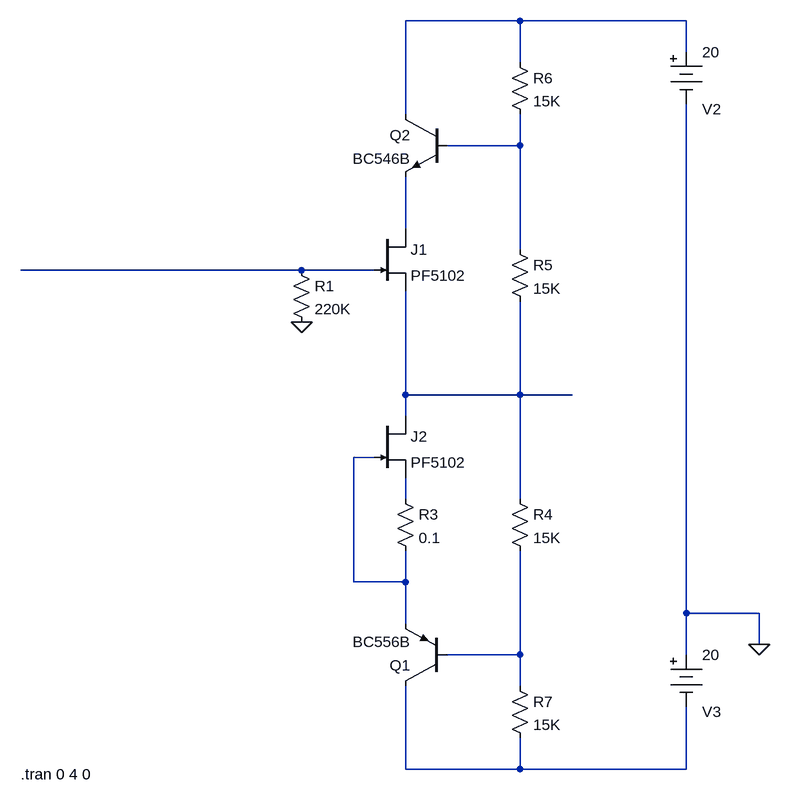
[diagram p0: schematic JFET BUFFER.asc]
JFET BUFFER.asc, the LTspice schematic file:
Version 4
SHEET 1 1024 1172
WIRE -128 -160 -304 -160
WIRE 128 -160 -128 -160
WIRE 128 -112 128 -160
WIRE -128 -96 -128 -160
WIRE -304 -16 -304 -160
WIRE -128 32 -128 -16
WIRE -128 32 -240 32
WIRE -304 160 -304 80
WIRE -128 192 -128 32
WIRE -464 224 -896 224
WIRE -352 224 -464 224
WIRE -304 416 -304 256
WIRE -128 416 -128 272
WIRE -128 416 -304 416
WIRE -48 416 -128 416
WIRE -304 448 -304 416
WIRE -352 512 -384 512
WIRE -304 576 -304 544
WIRE -128 576 -128 416
WIRE -384 704 -384 512
WIRE -304 704 -304 656
WIRE -304 704 -384 704
WIRE 128 752 128 -32
WIRE 240 752 128 752
WIRE -304 768 -304 704
WIRE 240 800 240 752
WIRE -128 816 -128 656
WIRE -128 816 -240 816
WIRE 128 816 128 752
WIRE -128 864 -128 816
WIRE -304 992 -304 864
WIRE -128 992 -128 944
WIRE -128 992 -304 992
WIRE 128 992 128 896
WIRE 128 992 -128 992
FLAG -464 304 0
FLAG 240 800 0
SYMBOL njf -352 160 R0
SYMATTR InstName J1
SYMATTR Value PF5102
SYMBOL res -480 208 R0
SYMATTR InstName R1
SYMATTR Value 220K
SYMBOL njf -352 448 R0
SYMATTR InstName J2
SYMATTR Value PF5102
SYMBOL res -320 560 R0
SYMATTR InstName R3
SYMATTR Value 0.1
SYMBOL pnp -240 864 R180
SYMATTR InstName Q1
SYMATTR Value BC556B
SYMBOL npn -240 -16 M0
SYMATTR InstName Q2
SYMATTR Value BC546B
SYMBOL res -144 560 R0
SYMATTR InstName R4
SYMATTR Value 15K
SYMBOL res -144 176 R0
SYMATTR InstName R5
SYMATTR Value 15K
SYMBOL res -144 -112 R0
SYMATTR InstName R6
SYMATTR Value 15K
SYMBOL res -144 848 R0
SYMATTR InstName R7
SYMATTR Value 15K
SYMBOL Misc\\battery 128 -128 R0
WINDOW 0 24 104 Left 2
WINDOW 3 24 16 Left 2
WINDOW 123 0 0 Left 2
WINDOW 39 0 0 Left 2
SYMATTR InstName V2
SYMATTR Value 20
SYMBOL Misc\\battery 128 800 R0
WINDOW 0 24 104 Left 2
WINDOW 3 24 16 Left 2
WINDOW 123 0 0 Left 2
WINDOW 39 0 0 Left 2
SYMATTR InstName V3
SYMATTR Value 20
TEXT -896 1000 Left 2 !.tran 0 4 0

The netlist it stands for:
* JFET BUFFER.asc
J1 N003 N004 N005 PF5102
R1 N004 0 220K
J2 N005 N006 N007 PF5102
R3 N007 N006 0.1
Q1 N009 N008 N006 0 BC556B
Q2 N001 N002 N003 0 BC546B
R4 N005 N008 15K
R5 N002 N005 15K
R6 N001 N002 15K
R7 N008 N009 15K
V2 N001 0 20
V3 0 N009 20
.model NPN NPN
.model PNP PNP
.lib standard.bjt
.model NJF NJF
.model PJF PJF
.lib standard.jft
.tran 0 4 0
.backanno
.end